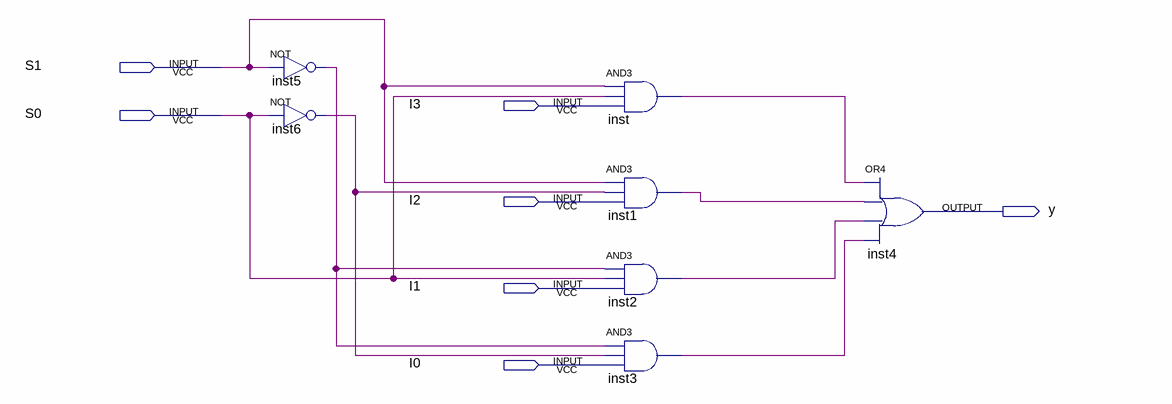
[diagram p0: schematic sheet]
// Quartus schematic 4to1MUX.bdf as structural Verilog: 7 symbols, 7 pins
module \4to1MUX  (
  input  S1,
  input  I3,
  input  S0,
  input  I2,
  input  I1,
  input  I0,
  output y
);

  wire inst1_out, inst2_out, inst3_out, inst5_out, inst6_out, inst_out;

  not inst5 (inst5_out, S1);
  not inst6 (inst6_out, S0);
  and inst (inst_out, S1, S0, I3);
  and inst1 (inst1_out, S1, inst6_out, I2);
  and inst2 (inst2_out, inst5_out, S0, I1);
  and inst3 (inst3_out, inst5_out, inst6_out, I0);
  or inst4 (y, inst_out, inst1_out, inst2_out, inst3_out);
endmodule
